# EAGLE design tempsensor_V3_02 (EAGLE 9.6.0)
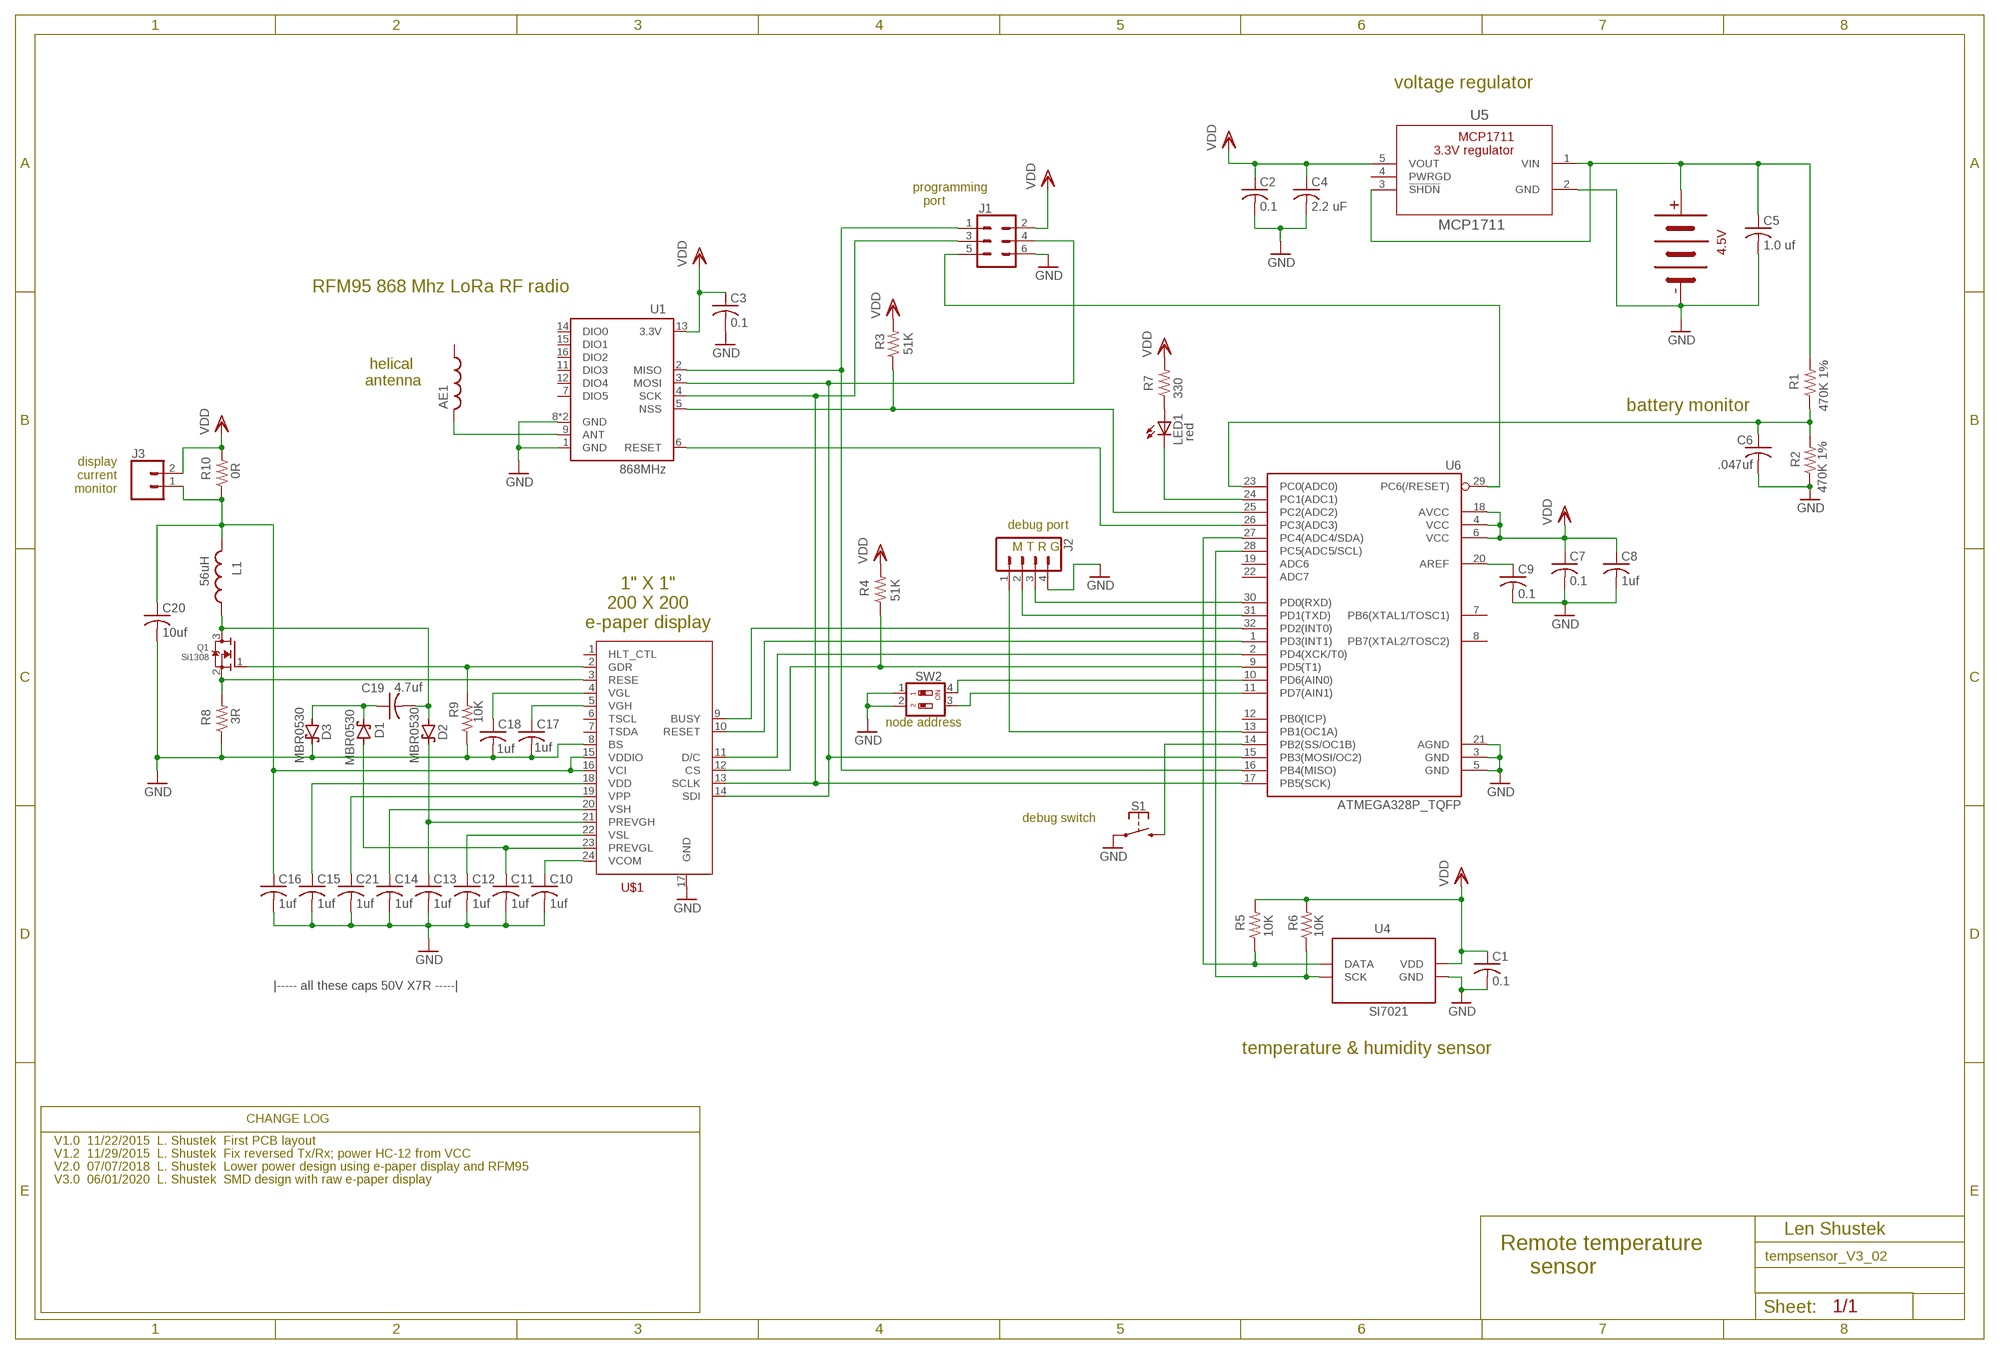
[diagram p0: schematic, sheet 1]

## Parts
AE1  ANTENNA-HELICAL  [ANTENNA-HELICAL_PULSE_SMD]
B1  3PC-BATTERY-HOLDER  [3AAA-BATTERY-HOLDER]
C1  0.1  C-USC0805  [C0805]
C2  0.1  C-USC0805  [C0805]
C3  0.1  C-USC0805  [C0805]
C4  2.2 uF  C-USC1210  [C1210]
C5  1.0 uf  C-USC0805  [C0805]
C6  .047uf  C-USC0805  [C0805]
C7  0.1  C-USC0805  [C0805]
C8  1uf  C-USC0805  [C0805]
C9  0.1  C-USC0805  [C0805]
C10  1uf  C-USC0805  [C0805]
C11  1uf  C-USC0805  [C0805]
C12  1uf  C-USC0805  [C0805]
C13  1uf  C-USC0805  [C0805]
C14  1uf  C-USC0805  [C0805]
C15  1uf  C-USC0805  [C0805]
C16  1uf  C-USC0805  [C0805]
C17  1uf  C-USC0805  [C0805]
C18  1uf  C-USC0805  [C0805]
C19  4.7uf  C-USC1210  [C1210]
C20  10uf  C-USC1210  [C1210]
C21  1uf  C-USC0805  [C0805]
D1  MBR0530  DIODE,SCHOTTKY  [SOD123-2]
D2  MBR0530  DIODE,SCHOTTKY  [SOD123-2]
D3  MBR0530  DIODE,SCHOTTKY  [SOD123-2]
J1  CONN_2X3  [2X3_SMT_RTANGLE_OUTLINE]
J2  CONN_04  [1X04]
J3  CONN_02  [1X02]
L1  56uH  L-USL1812  [L1812]
LED1  red  LEDPLCC-2  [LED_PLCC-2]
Q1  Si1308  MOSFET-NSC70-3-SMT  [SC70-3-R]
R1  470K 1%  R-US_M0805  [M0805]
R2  470K 1%  R-US_M0805  [M0805]
R3  51K  R-US_M0805  [M0805]
R4  51K  R-US_M0805  [M0805]
R5  10K  R-US_M0805  [M0805]
R6  10K  R-US_M0805  [M0805]
R7  330  R-US_M0805  [M0805]
R8  3R  R-US_M0805  [M0805]
R9  10K  R-US_M0805  [M0805]
R10  0R  R-US_M0805  [M0805]
S1  PUSHBUTTON-SPSTSWITCH_C&K_GULLWING_5MM  [SWITCH_C&K_GULLWING_5MM]
SW2  SWITCH-2POS-DIP  [SMS-002]
U1  868MHz  RFM69HCW-915  [RFM69HCW-XXXS2]
U4  SI7021  [DFN-6-3X3-SI7021]
U5  MCP1711  [SOT-23-5]
U6  ATMEGA328P_TQFP  [TQFP32-08]
U$1  E-PAPER-DISPLAYMOLEX  [MOLEX_50511]

## Nets
GND [GND]: B1.P$1 C1.2 C2.2 C3.2 C4.2 C5.2 C6.2 C7.2 C8.2 C9.2 C10.2 C11.2 C12.2 C13.2 C14.2 C15.2 C16.2 C17.2 C18.2 C20.2 C21.2 D3.P$2(C) J1.6 J2.4 R2.1 R8.1 R9.1 S1.P$1 S1.P$2 SW2.1 SW2.2 U1.1(GND) U1.8(GND) U1.10(GND) U4.GND U5.2(GND) U6.3(GND) U6.5(GND) U6.21(AGND) U$1.8(BS) U$1.17(GND)
N$1: R6.1 U4.SCK U6.28(PC5(ADC5/SCL))
N$2: R5.1 U4.DATA U6.27(PC4(ADC4/SDA))
N$3: J1.4 U1.3(MOSI) U6.15(PB3(MOSI/OC2)) U$1.14(SDI)
N$4: J1.1 U1.2(MISO) U6.16(PB4(MISO))
N$5: J1.3 U1.4(SCK) U6.17(PB5(SCK)) U$1.13(SCLK)
N$6: U1.6(RESET) U6.26(PC3(ADC3))
N$7: R3.1 U1.5(NSS) U6.25(PC2(ADC2))
N$8: U6.32(PD2(INT0)) U$1.9(BUSY)
N$9: U6.1(PD3(INT1)) U$1.10(RESET)
N$10: U6.2(PD4(XCK/T0)) U$1.11(D/C)
N$11: R4.1 U6.9(PD5(T1)) U$1.12(CS)
N$12: J2.2 U6.31(PD1(TXD))
N$13: LED1.P$2(C) U6.24(PC1(ADC1))
N$14: LED1.P$1(A) R7.1
N$15: SW2.4 U6.10(PD6(AIN0))
N$16: SW2.3 U6.11(PD7(AIN1))
N$17 [VCC]: B1.P$2 C5.1 R1.2 U5.1(VIN) U5.3(!SHDN)
N$18: C9.1 U6.20(AREF)
N$19 [VCC]: AE1.P$1 U1.9(ANT)
N$20: J1.5 U6.29(PC6(/RESET))
N$21: C10.1 U$1.24(VCOM)
N$22: C11.1 D1.P$1(A) U$1.23(PREVGL)
N$23: C12.1 U$1.22(VSL)
N$24: C13.1 D2.P$2(C) U$1.21(PREVGH)
N$25: C14.1 U$1.20(VSH)
N$26 [VCC]: C16.1 C20.1 J3.1 L1.2 R10.1 U$1.15(VDDIO) U$1.16(VCI)
N$27: C6.1 R1.1 R2.2 U6.23(PC0(ADC0))
N$28: C15.1 U$1.18(VDD)
N$29: C21.1 U$1.19(VPP)
N$30: C17.1 U$1.5(VGH)
N$31: J2.1 U6.13(PB1(OC1A))
N$32: C18.1 U$1.4(VGL)
N$33: C19.2 D2.P$1(A) L1.1 Q1.3(D)
N$34: C19.1 D1.P$2(C) D3.P$1(A)
N$35: Q1.1(G) R9.2 U$1.2(GDR)
N$36: Q1.2(S) R8.2 U$1.3(RESE)
N$37: J2.3 U6.30(PD0(RXD))
N$38: S1.P$3 S1.P$4 U6.14(PB2(SS/OC1B))
VDD [VCC]: C1.1 C2.1 C3.1 C4.1 C7.1 C8.1 J1.2 J3.2 R3.2 R4.2 R5.2 R6.2 R7.2 R10.2 U1.13(3.3V) U4.VDD U5.5(VOUT) U6.4(VCC) U6.6(VCC) U6.18(AVCC)
Unconnected: AE1.P$2 U1.7(DIO5) U1.11(DIO3) U1.12(DIO4) U1.14(DIO0) U1.15(DIO1) U1.16(DIO2) U6.7(PB6(XTAL1/TOSC1)) U6.8(PB7(XTAL2/TOSC2)) U6.12(PB0(ICP)) U6.19(ADC6) U6.22(ADC7) U$1.1(HLT_CTL) U$1.6(TSCL) U$1.7(TSDA)

## Notes on the sheet
- voltage regulator
- programming
     port
- RFM95 868 Mhz LoRa RF radio
- helical
  antenna
- battery monitor
- display
  current
  monitor
- debug port
- M T R G
- 1" X 1"
  200 X 200
  e-paper display
- node address
- debug switch
- |----- all these caps 50V X7R -----|
- temperature & humidity sensor
- CHANGE LOG
- V1.0  11/22/2015  L. Shustek  First PCB layout
- V1.2  11/29/2015  L. Shustek  Fix reversed Tx/Rx; power HC-12 from VCC
- V2.0  07/07/2018  L. Shustek  Lower power design using e-paper display and RFM95
- V3.0  06/01/2020  L. Shustek  SMD design with raw e-paper display
- Len Shustek
- Remote temperature
       sensor

## Power pins joined to a net without a drawn wire
PWRGD: U5.4(PWRGD)

## Library data of the parts
AE1 = Len:ANTENNA-HELICAL
B1 = Len:3PC-BATTERY-HOLDER
C1-C21 = resistor:C-US: CAPACITOR, American symbol
D1-D3 = Len:DIODE,SCHOTTKY: Schottky diode
J1 = Len:CONN_2X3: Multi connection point. Often used as Generic Header-pin footprint for 0.1 inch spaced/style header connections You can populate with any combo of single row headers, but if you'd like an exact match, check these: Header - 2x3 (Male, 0.1") <https://www.sparkfun.com/products/12807> (PRT-12807) Header - 2x3 (Female, 0.1") <https://www.sparkfun.com/products/13010> (PRT-13010) 2x3 Pin Shrouded Header <https://www.sparkfun.com/products/10877> (PRT-10877) On any of the 0.1 inch spaced packages, you can populate with these: Break Away Headers - Straight <https://www.sparkfun.com/products/116> (PRT-00116) Break Away Male Headers - Right Angle <https://www.sparkfun.com/products/553> (PRT-00553) Female Headers <https://www.sparkfun.com/products/115> (PRT-00115) Break Away Headers - Machine Pin <https://www.sparkfun.com/products/117> (PRT-00117) Break Away Female Headers - Swiss Machine Pin <https://www.sparkfun.com/products/743> (PRT-00743) Special note: the shrouded connector mates well with our 3x2 ribbon cables: Ribbon Crimp Connector - 6-pin (2x3, Female) <https://www.sparkfun.com/products/10651> (PRT-10651) Ribbon Cable - 6 wire (15ft) <https://www.sparkfun.com/products/10646> (PRT-10646)
J2 = SparkFun-Connectors:CONN_04: Multi connection point. Often used as Generic Header-pin footprint for 0.1 inch spaced/style header connections On any of the 0.1 inch spaced packages, you can populate with these: Break Away Headers - Straight <https://www.sparkfun.com/products/116> (PRT-00116) Break Away Male Headers - Right Angle <https://www.sparkfun.com/products/553> (PRT-00553) Female Headers <https://www.sparkfun.com/products/115> (PRT-00115) Break Away Headers - Machine Pin <https://www.sparkfun.com/products/117> (PRT-00117) Break Away Female Headers - Swiss Machine Pin <https://www.sparkfun.com/products/743> (PRT-00743) For SCREWTERMINALS and SPRING TERMINALS visit here: Screw Terimnals on SparkFun.com <https://www.sparkfun.com/search/results?term=Screw+Terminals> (5mm/3.5mm/2.54mm spacing) This device is also useful as a general connection point to wire up your design to another part of your project. Our various solder wires solder well into these plated through hole pads. Hook-Up Wire - Assortment (Stranded, 22 AWG) <https://www.sparkfun.com/products/11375> (PRT-11375) Hook-Up Wire - Assortment (Solid Core, 22 AWG) <https://www.sparkfun.com/products/11367> (PRT-11367) View the entire wire category on our website here <https://www.sparkfun.com/categories/141> Special notes: Molex polarized connector foot print use with SKU : PRT-08231 with associated crimp pins and housings. 1MM SMD Version SKU: PRT-10208; PROD_ID: CONN-09696
J3 = SparkFun-Connectors:CONN_02: Multi connection point. Often used as Generic Header-pin footprint for 0.1 inch spaced/style header connections On any of the 0.1 inch spaced packages, you can populate with these: Break Away Headers - Straight <https://www.sparkfun.com/products/116> (PRT-00116) Break Away Male Headers - Right Angle <https://www.sparkfun.com/products/553> (PRT-00553) Female Headers <https://www.sparkfun.com/products/115> (PRT-00115) Break Away Headers - Machine Pin <https://www.sparkfun.com/products/117> (PRT-00117) Break Away Female Headers - Swiss Machine Pin <https://www.sparkfun.com/products/743> (PRT-00743) For SCREWTERMINALS and SPRING TERMINALS visit here: Screw Terimnals on SparkFun.com <https://www.sparkfun.com/search/results?term=Screw+Terminals> (5mm/3.5mm/2.54mm spacing) This device is also useful as a general connection point to wire up your design to another part of your project. Our various solder wires solder well into these plated through hole pads. Hook-Up Wire - Assortment (Stranded, 22 AWG) <https://www.sparkfun.com/products/11375> (PRT-11375) Hook-Up Wire - Assortment (Solid Core, 22 AWG) <https://www.sparkfun.com/products/11367> (PRT-11367) View the entire wire category on our website here <https://www.sparkfun.com/categories/141> Special notes: Molex polarized connector foot print use with: PRT-08233 with associated crimp pins and housings. 2.54_SCREWTERM for use with PRT-10571. 3.5mm Screw Terminal footprints for PRT-08084 5mm Screw Terminal footprints for use with PRT-08432
L1 = resistor:L-US: INDUCTOR, American symbol
LED1 = Len:LED: LED OSRAM: - CHIPLED LG R971, LG N971, LY N971, LG Q971, LY Q971, LO R971, LY R971 LH N974, LH R974 LS Q976, LO Q976, LY Q976 LO Q996 - Hyper CHIPLED LW Q18S LB Q993, LB Q99A, LB R99A - SideLED LS A670, LO A670, LY A670, LG A670, LP A670 LB A673, LV A673, LT A673, LW A673 LH A674 LY A675 LS A676, LA A676, LO A676, LY A676, LW A676 LS A679, LY A679, LG A679 - Hyper Micro SIDELED® LS Y876, LA Y876, LO Y876, LY Y876 LT Y87S - SmartLED LW L88C, LW L88S LB L89C, LB L89S, LG L890 LS L89K, LO L89K, LY L89K LS L896, LA L896, LO L896, LY L896 - TOPLED LS T670, LO T670, LY T670, LG T670, LP T670 LSG T670, LSP T670, LSY T670, LOP T670, LYG T670 LG T671, LOG T671, LSG T671 LB T673, LV T673, LT T673, LW T673 LH T674 LS T676, LA T676, LO T676, LY T676, LB T676, LH T676, LSB T676, LW T676 LB T67C, LV T67C, LT T67C, LS T67K, LO T67K, LY T67K, LW E67C LS E67B, LA E67B, LO E67B, LY E67B, LB E67C, LV E67C, LT E67C LW T67C LS T679, LY T679, LG T679 LS T770, LO T770, LY T770, LG T770, LP T770 LB T773, LV T773, LT T773, LW T773 LH T774 LS E675, LA E675, LY E675, LS T675 LS T776, LA T776, LO T776, LY T776, LB T776 LHGB T686 LT T68C, LB T68C - Hyper Mini TOPLED® LB M676 - Mini TOPLED Santana® LG M470 LS M47K, LO M47K, LY M47K Source: http://www.osram.convergy.de/
Q1 = Len:MOSFET-N: N-Channel Mosfet 2N7002E - 60V 260mA SOT23 [Digikey: 2N7002ET1GOSTR-ND] - REEL BSH103 - 30V 850mA SOT23 [Digikey: 568-5013-1-ND]
R1-R10 = resistor:R-US_: RESISTOR, American symbol
S1 = Len:PUSHBUTTON-SPST: Momentary Switch (Pushbutton) - SPST - Two Circuits Normally-open (NO) SPST momentary switches
SW2 = Len:SWITCH-2POS-DIP: SMD Dip Switch 2 pol.
U1 = SparkFun-RF:RFM69H: Hope RF RFM69H ISM Transceiver Module The RFM69H is a transceiver module capable of operation over a wide frequency range, including the 315,433,868 and 915MHz license-free ISM (Industry Scientific and Medical) frequency bands. All major RF communication parameters are programmable and most of them can be dynamically set. The RFM69H offers the unique advantage of programmable narrow-band and wide- band communication modes. The RFM69H is optimized for low power consumption while offering high RF output power and channelized operation.Compliance ETSI and FCC regulations. Datasheet <http://www.hoperf.cn/upload/docs/RF/SX/RFM69H_DataSheet_v1.3.pdf> SparkFun Products RFM69HCW Wireless Transceiver - 915MHz <https://www.sparkfun.com/products/13909> (COM-13909) RFM69HCW Wireless Transceiver - 434MHz <https://www.sparkfun.com/products/13910> (COM-13910) SparkFun RFM69 Breakout (915MHz) <https://www.sparkfun.com/products/12775> (WRL-12775) SparkFun RFM69 Breakout (434MHz) <https://www.sparkfun.com/products/12823> (WRL-12823); PROD_ID: IC-11997; VALUE: 915MHz
U4 = Len:SI7021: Silicon Labs Si7021 I2C Humidity and Temperature Sensor The Si7021 is a low-cost, easy-to-use, highly accurate, digital humidity and temperature sensor. This sensor is ideal for environmental sensing and data logging and perfect for build a weather stations or humidor control system. All you need are two lines for I2C communication, and you’ll have relative humidity readings and very accurate temperature readings as a bonus! Datasheet <https://cdn.sparkfun.com/datasheets/Sensors/Weather/Si7021.pdf> SparkFun Products SparkFun Humidity and Temperature Sensor Breakout - Si7021 <https://www.sparkfun.com/products/13763> (SEN-13763) SparkFun Blynk Board - ESP8266 <https://www.sparkfun.com/products/13794> (WRL-13794); PROD_ID: IC-13093
U5 = MCP_1711:MCP1711; MANUFACTURER_PART_NUMBER: mcp1754; VENDOR: Microchip
U6 = SparkFun-IC-Microcontroller:ATMEGA328P_TQFP: Popular 328P in QFP Storefront component: ATmega328 - TQFP <https://www.sparkfun.com/products/13448> (COM-13448) Datasheet <http://www.sparkfun.com/datasheets/Components/SMD/ATMega328.pdf> SparkFun Products SparkFun RedBoard - Programmed with Arduino <https://www.sparkfun.com/products/12757> (DEV-12757) Arduino Pro Mini 328 - 5V/16MHz <https://www.sparkfun.com/products/11113> (DEV-11113) Arduino Pro Mini 328 - 3.3V/8MHz <https://www.sparkfun.com/products/11114> (DEV-11114) SparkFun OpenLog <https://www.sparkfun.com/products/13712> (DEV-13712) SparkFun MicroView - OLED Arduino Module <https://www.sparkfun.com/products/12923> (DEV-12923) SparkFun Digital Sandbox <https://www.sparkfun.com/products/12651> (DEV-12651) SparkFun PicoBoard <https://www.sparkfun.com/products/11888> (WIG-11888) Arduino Fio <https://www.sparkfun.com/products/10116> (DEV-10116) LilyPad Arduino 328 Main Board <https://www.sparkfun.com/products/13342> (DEV-13342) SparkFun RedStick <https://www.sparkfun.com/products/13741> (DEV-13741) LilyPad MP3 <https://www.sparkfun.com/products/11013> (DEV-11013) LilyPad Arduino SimpleSnap <https://www.sparkfun.com/products/10941> (DEV-10941) SparkFun Stepoko <https://www.sparkfun.com/products/13899> (ROB-13899) SparkFun Geiger Counter <https://www.sparkfun.com/products/11345> (SEN-11345) SparkFun EL Sequencer <https://www.sparkfun.com/products/12781> (COM-12781) Arduino Pro 328 - 5V/16MHz <https://www.sparkfun.com/products/10915> (DEV-10915) CryptoCape <https://www.sparkfun.com/products/12773> (DEV-12773) SparkFun IR Thermometer Evaluation Board - MLX90614 <https://www.sparkfun.com/products/10740> (SEN-10740) SparkFun RedBot Mainboard <https://www.sparkfun.com/products/12097> (ROB-12097) Arduino Pro 328 - 3.3V/8MHz <https://www.sparkfun.com/products/10914> (DEV-10914) SparkFun Block for Intel® Edison - Arduino <https://www.sparkfun.com/products/13036> (DEV-13036) SparkFun Simon Says - Surface Mount Soldering Kit <https://www.sparkfun.com/products/10935> (KIT-10935) SparkFun 7-Segment Serial Display - Red <https://www.sparkfun.com/products/11441> (COM-11441) SparkFun 7-Segment Serial Display - White <https://www.sparkfun.com/products/11629> (COM-11629) SparkFun 7-Segment Serial Display - Yellow <https://www.sparkfun.com/products/11443> (COM-11443) SparkFun 7-Segment Serial Display - Kelly Green <https://www.sparkfun.com/products/11440> (COM-11440) SparkFun 7-Segment Serial Display - Blue <https://www.sparkfun.com/products/11442> (COM-11442) SparkFun OpenSegment Serial Display - 20mm (Blue) <https://www.sparkfun.com/products/11647> (COM-11647) SparkFun OpenSegment Serial Display - 20mm (Green) <https://www.sparkfun.com/products/11646> (COM-11646) SparkFun OpenSegment Serial Display - 20mm (White) <https://www.sparkfun.com/products/11648> (COM-11648) SparkFun OpenSegment Serial Display - 20mm (Red) <https://www.sparkfun.com/products/11644> (COM-11644) SparkFun OpenSegment Serial Display - 20mm (Yellow) <https://www.sparkfun.com/products/11645> (COM-11645) SparkFun OpenSegment Shield <https://www.sparkfun.com/products/13190> (DEV-13190); PROD_ID: IC-09069
U$1 = Len:E-PAPER-DISPLAY: e-paper display

## Net classes
0 default: width 0.254 mm
1 GND: width 0.457 mm
2 VCC: width 0.457 mm

## Board
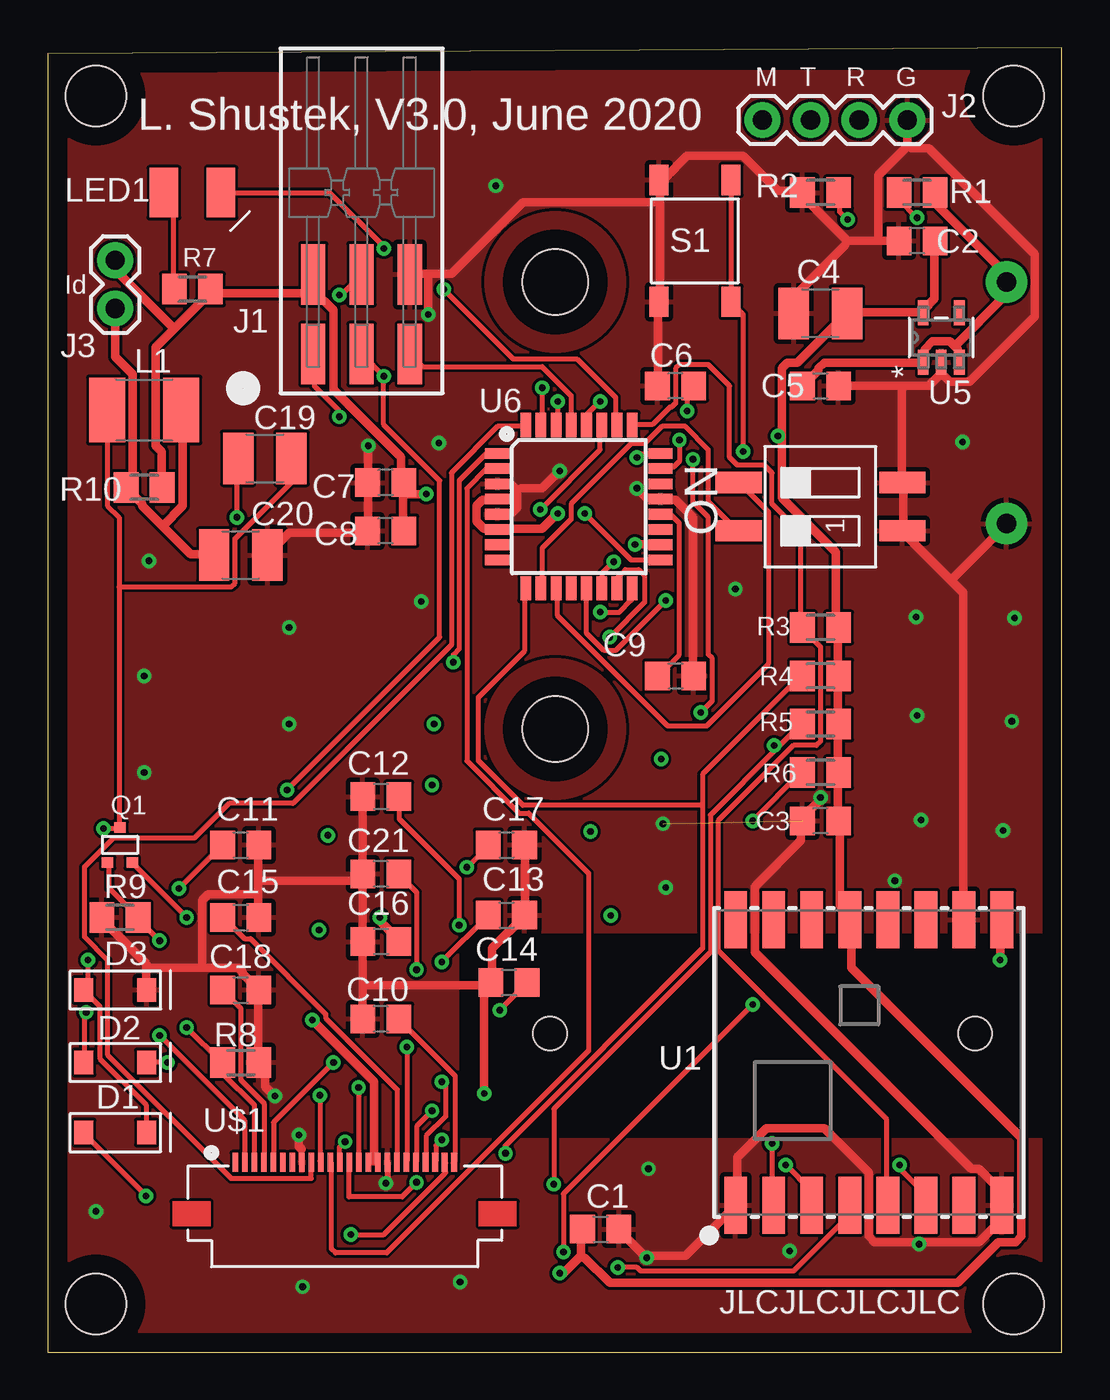
[diagram p1: board, top side]
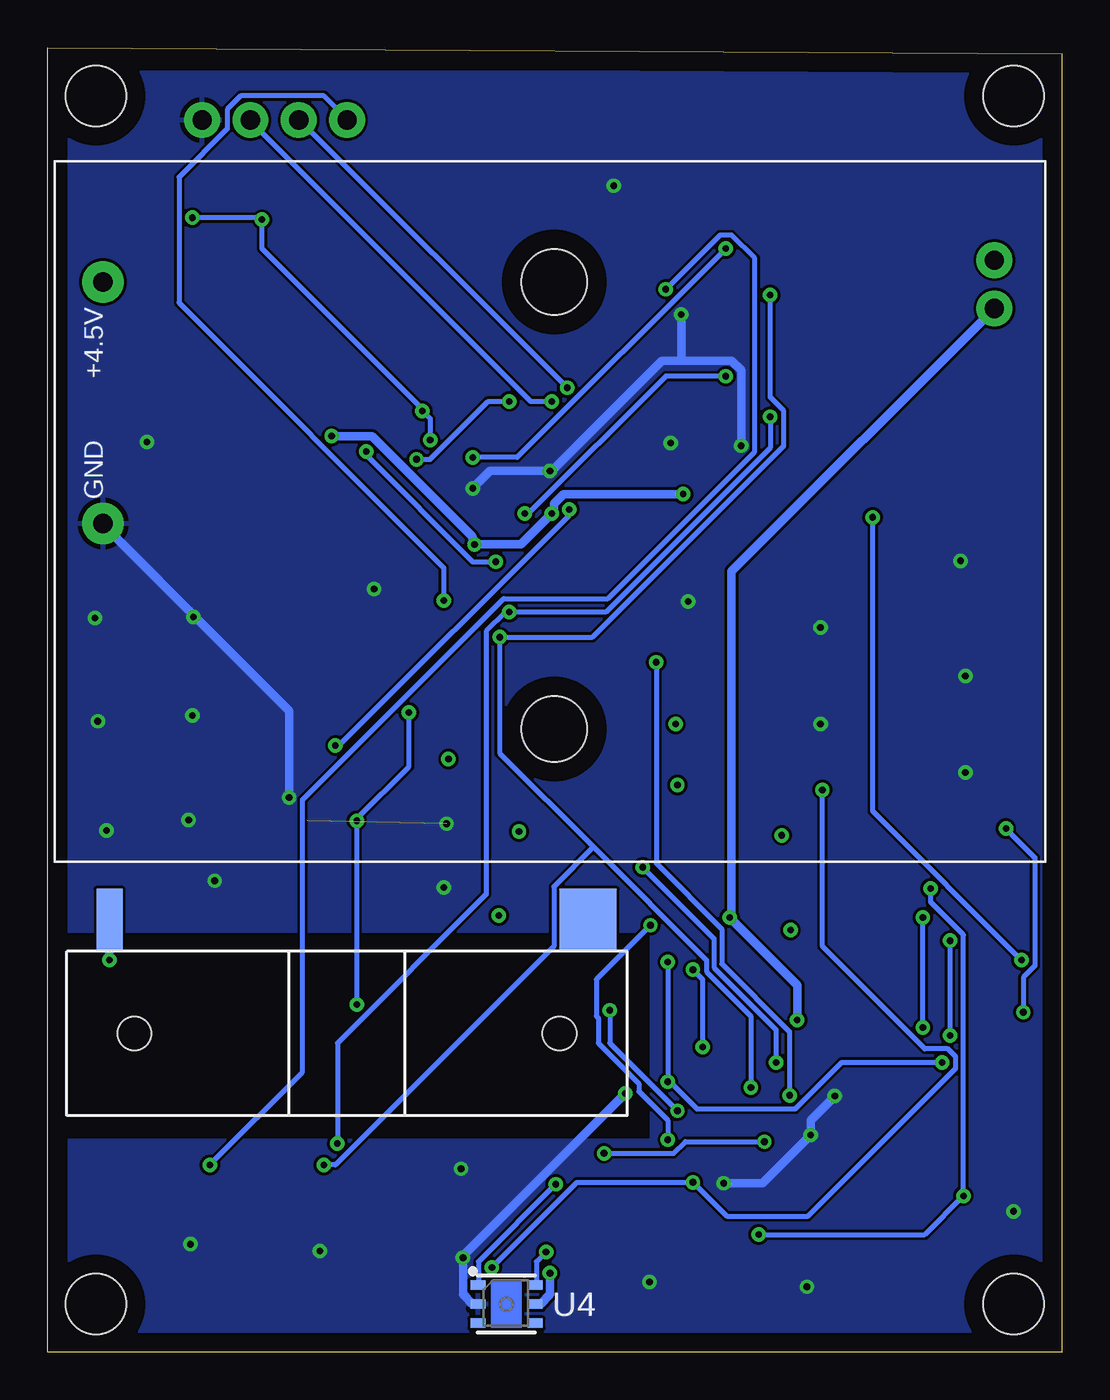
[diagram p2: board, bottom side, seen from below]

Size 53.34 x 68.58 mm. Coordinates in mm from the lower left corner, seen from the top.
Outline: 0,0 53.34,0 53.34,68.58 0,68.25 0,0
Copper layers (1*16): Top 0.035mm / dielectric 1.5mm / Bottom 0.035mm
Design rules "default": minimum track width 6mil, minimum drill 0.35mm, track to track 6mil, track to pad 6mil, pad to pad 6mil, via to via 6mil, smd to smd 6mil, copper to edge 40mil, drill to drill 6mil, minimum pad ring 10mil, minimum via ring 8mil, stop-mask expansion 4mil, vias tented up to drill 0mil, thermal gap 10mil
Holes 3.17 mm at 2.54,2.54 50.8,2.54 2.54,66.04 50.8,66.04

### Footprints (pad centres in the part's own frame; a part is rotated, then mirrored left to right if it is on the bottom)
ANTENNA-HELICAL_PULSE_SMD = smd 1.36 x 3.2: P$1 12.484,-6 | smd 3 x 3.2: P$2 -12.676,-6 | hole 1.778: -11.176,0; 11.176,0
3AAA-BATTERY-HOLDER = drill 1.016 pad 2.184: P$1 -6.35,0; P$2 6.35,0 | hole 3.454: 6.35,-23.724; -17.145,-23.724
C0805 = smd 1.3 x 1.5: 1 -0.95,0; 2 0.95,0
C1210 = smd 1.6 x 2.7: 1 -1.4,0; 2 1.4,0
SOD123-2 = smd 1 x 1.25: P$1 -1.65,0; P$2 1.65,0
2X3_SMT_RTANGLE_OUTLINE = smd 1.27 x 3.18: 1 2.54,2.146; 2 2.54,-2.045; 3 0,2.146; 4 0,-2.045; 5 -2.54,2.146; 6 -2.54,-2.045
1X04 = drill 1.016 pad 1.88: 1 0,0; 2 2.54,0; 3 5.08,0; 4 7.62,0
1X02 = drill 1.016 pad 1.88: 1 0,0; 2 2.54,0
L1812 = smd 1.9 x 3.4: 1 -1.95,0; 2 1.95,0
LED_PLCC-2 = smd 1.5 x 2.6: P$1 -1.5,0; P$2 1.5,0
SC70-3-R = smd 0.6 x 0.55: 1 -0.65,-0.925; 2 0.65,-0.925; 3 0,0.925
M0805 = smd 1.3 x 1.6: 1 -0.95,0; 2 0.95,0
SWITCH_C&K_GULLWING_5MM = smd 1.6 x 1: P$1 -3.2,1.9; P$2 3.2,1.9; P$3 -3.2,-1.9; P$4 3.2,-1.9
SMS-002 = smd 1.118 x 2.438: 1 -1.27,-4.305; 2 1.27,-4.305; 3 1.27,4.305; 4 -1.27,4.305
RFM69HCW-XXXS2 = smd 3 x 1.2: 1 -7.5,7; 2 -7.5,5; 3 -7.5,3; 4 -7.5,1; 5 -7.5,-1; 6 -7.5,-3; 7 -7.5,-5; 8 -7.5,-7; 9 7.5,-7; 10 7.5,-5; 11 7.5,-3; 12 7.5,-1; 13 7.5,1; 14 7.5,3; 15 7.5,5; 16 7.5,7
DFN-6-3X3-SI7021 = smd 0.8 x 0.5: DATA 1.5,-1; GND 1.5,0; NC@3 1.5,1; NC@4 -1.5,1; SCK -1.5,-1; VDD -1.5,0
SOT-23-5 = smd 1.321 x 0.559: 1 -1.295,0.95; 2 -1.295,0; 3 -1.295,-0.95; 4 1.295,-0.95; 5 1.295,0.95
TQFP32-08 = smd 1.27 x 0.559: 1 -4.293,2.8; 2 -4.293,2; 3 -4.293,1.2; 4 -4.293,0.4; 5 -4.293,-0.4; 6 -4.293,-1.2; 7 -4.293,-2; 8 -4.293,-2.8; 17 4.293,-2.8; 18 4.293,-2; 19 4.293,-1.2; 20 4.293,-0.4; 21 4.293,0.4; 22 4.293,1.2; 23 4.293,2; 24 4.293,2.8 | smd 0.559 x 1.27: 9 -2.8,-4.293; 10 -2,-4.293; 11 -1.2,-4.293; 12 -0.4,-4.293; 13 0.4,-4.293; 14 1.2,-4.293; 15 2,-4.293; 16 2.8,-4.293; 25 2.8,4.293; 26 2,4.293; 27 1.2,4.293; 28 0.4,4.293; 29 -0.4,4.293; 30 -1.2,4.293; 31 -2,4.293; 32 -2.8,4.293
MOLEX_50511 = smd 0.3 x 1: 1 -5.75,2.5; 2 -5.25,2.5; 3 -4.75,2.5; 4 -4.25,2.5; 5 -3.75,2.5; 6 -3.25,2.5; 7 -2.75,2.5; 8 -2.25,2.5; 9 -1.75,2.5; 10 -1.25,2.5; 11 -0.75,2.5; 12 -0.25,2.5; 13 0.25,2.5; 14 0.75,2.5; 15 1.25,2.5; 16 1.75,2.5; 17 2.25,2.5; 18 2.75,2.5; 19 3.25,2.5; 20 3.75,2.5; 21 4.25,2.5; 22 4.75,2.5; 23 5.25,2.5; 24 5.75,2.5

### Placement (x,y rotation side)
AE1  37.59,16.76 180 bottom
B1  50.42,49.91 90 bottom
C1  29.08,6.48 0 top
C2  45.72,58.42 180 top
C3  40.64,27.94 180 top
C4  40.64,54.61 180 top
C5  40.64,50.8 0 top
C6  33.02,50.8 180 top
C7  17.78,45.72 180 top
C8  17.78,43.18 180 top
C9  33.02,35.56 0 top
C10  17.53,17.53 180 top
C11  10.16,26.67 0 top
C12  17.53,29.21 180 top
C13  24.13,22.99 0 top
C14  24.26,19.43 180 top
C15  10.16,22.86 0 top
C16  17.53,21.59 180 top
C17  24.13,26.67 0 top
C18  10.16,19.05 0 top
C19  11.43,46.99 0 top
C20  10.16,41.91 0 top
C21  17.53,25.15 180 top
D1  3.56,11.56 0 top
D2  3.56,15.24 0 top
D3  3.56,19.05 0 top
J1  16.51,54.61 180 top
J2  37.59,64.77 0 top
J3  3.56,54.86 90 top
L1  5.08,49.53 0 top
LED1  7.62,60.96 0 top
Q1  3.81,26.67 0 top
R1  45.72,60.96 0 top
R2  40.64,60.96 0 top
R3  40.64,38.1 0 top
R4  40.64,35.56 0 top
R5  40.64,33.02 0 top
R6  40.64,30.48 0 top
R7  7.62,55.88 0 top
R8  10.16,15.24 180 top
R9  3.81,22.86 0 top
R10  5.08,45.47 0 top
S1  34.04,58.42 90 top
SW2  40.64,44.45 90 top
U1  43.18,15.24 90 top
U4  29.21,2.54 180 bottom
U5  46.99,53.34 90 top
U6  27.94,44.45 0 top
U$1  15.62,7.49 0 top

### Tracks (layer width: path | path; a pad name or v marks a point on that pad's centre or on a via)
GND  (via drill 0.35)  (1 unrouted)
  Top 0.305: U$1.17 17.87,8.98 | U$1.8 13.37,10.68
  Top 0.457: 5.18,20.22 5.18,20.42 2.95,22.66 2.95,22.86 R9.1 | 5.18,20.22 5.18,19.1 D3.P$2 | 5.18,20.22 8.13,20.22 | 8.13,20.22 10.06,20.22 10.26,20.02 10.26,19.91 10.97,19.2 C18.2 11.07,19 11.07,15.24 R8.1 11.43,14.92 11.43,13.97 11.93,13.47 v11.95,13.47 | C14.2 23.37,19.51 23.37,21.23 25.09,22.96 C13.2 25.09,23.16 25.09,26.62 C17.2 | 11.07,24.79 11.07,26.62 C11.2 | 11.07,24.79 11.07,24.08 | 11.07,24.08 11.07,22.86 C15.2 | 16.56,19.3 16.56,21.54 C16.2 16.56,21.74 16.56,25.09 C21.2 | 16.56,19.3 16.56,17.58 C10.2 | C12.2 16.56,29.16 16.56,25.3 C21.2 | 11.07,24.79 16.36,24.79 C21.2 | 16.56,19.3 23.16,19.3 C14.2 | 8.13,20.22 8.13,23.77 8.43,24.08 11.07,24.08 | C1.2 30.07,6.4 v31.5,4.98 31.7,5.08 33.53,5.08 36.17,7.72 U1.1 36.27,7.92 36.27,10.26 37.8,11.79 40.84,11.79 43.18,9.45 43.18,6.1 43.48,5.79 48.97,5.79 50.09,6.91 50.09,7.52 U1.8 50.09,7.82 50.09,8.53 48.97,9.65 48.56,9.65 37.19,21.03 37.19,24.49 39.62,26.92 39.62,27.94 C3.2 39.73,28.14 40.64,29.06 v40.64,29.16 | v22.96,13.61 22.96,19.1 C14.2 | 46.94,51.41 46.94,52.02 U5.2 | 46.94,51.41 46.33,50.8 44.91,50.8 | C5.2 44.91,50.8 | 47.5,40.59 45.11,42.98 SW2.1 45.01,43.18 45.01,45.72 SW2.2 44.91,45.92 44.91,50.8 | 47.5,40.59 48.16,39.93 48.16,22.76 U1.10 | 47.5,40.59 50.39,43.48 B1.P$1 | C20.2 11.58,41.96 12.7,43.08 16.66,43.08 C8.2 16.87,43.18 16.87,45.72 C7.2 16.87,45.92 v16.87,47.65 | 24.69,45.31 24.69,44.4 24.38,44.09 23.67,44.09 U6.5 | 24.69,45.31 24.38,45.62 23.67,45.62 U6.3 | C9.2 33.93,35.56 33.93,43.89 33.02,44.81 32.31,44.81 U6.21 32,44.91 31.5,44.91 v30.99,45.41 | v26.92,46.33 26.01,45.41 24.89,45.41 24.69,45.31
  Top 0.457: 42.06,58.42 43.69,58.42 | 43.69,58.42 C2.2 | 42.06,58.42 39.73,60.76 39.73,60.96 R2.1 39.52,61.06 38.41,61.06 36.58,62.89 33.63,62.89 32.41,61.67 S1.P$2 32.21,61.57 32.21,60.45 | C4.2 39.32,54.66 39.32,55.58 41.96,58.22 42.06,58.42 | 45.21,63.4 J2.4 | 45.21,63.4 43.69,61.87 43.69,58.42 | C6.2 32.11,50.8 32.11,55.17 S1.P$1 32.21,55.37 32.21,60.45 | 20.02,56.69 21.23,56.69 24.99,60.45 32.21,60.45 | 20.02,56.69 19.1,56.69 J1.6 | 20.02,56.69 v20.02,54.56 | 46.94,51.41 47.14,51.31 47.45,51 48.46,51 51.92,54.46 51.92,57.71 46.33,63.3 45.41,63.3 45.21,63.4 | 17.87,8.98 v17.78,8.89 | v13.21,11.43 13.21,10.85 13.37,10.68
  Bottom 0.457: U4.GND 30.99,2.54 31.5,3.05 v31.5,4.98 31.39,5.18 v22.96,13.61 | v30.99,45.41 30.07,46.33 v26.92,46.33 26.72,46.43 21.03,52.12 20.02,52.12 | v16.87,47.65 16.87,51.61 17.37,52.12 20.02,52.12 | v20.02,54.56 20.02,52.12 | v40.64,29.16 40.64,33.73 50.39,43.48 B1.P$1 | v17.78,8.89 15.75,8.89 v13.21,11.43 13.21,12.21 v11.95,13.47
  other vias: 5.08,35.56 5.08,30.48 5.33,41.61 12.7,38.1 12.7,33.02 19.66,39.47 45.92,27.99 45.72,33.48 45.67,38.66 50.85,38.61 50.7,33.17 50.24,27.43 48.11,47.85 23.57,61.32 20.57,47.8 36.17,40.13 32.36,27.79 32.51,24.43 44.55,24.79 45.82,5.69 39.01,5.33 31.6,9.65 21.69,3.71 13.41,3.45 2.54,7.42
  pour Bottom: 0.76,67.31 0.76,0.51 52.32,0.51 52.32,11.18 21.59,11.18 21.59,22.1 52.32,22.1 52.32,67.31
  pour Top: 1.02,67.31 1.02,0.25 52.58,0.25 52.58,11.18 21.59,11.18 21.59,22.1 52.32,22.1 52.32,67.31
N$1  (via drill 0.35)
  Top 0.254: v27.13,5.28 27.13,8.33 v37.08,18.29 | v37.08,27.94 39.62,30.48 R6.1 | v29.06,49.99 28.35,49.28 28.35,48.77 U6.28 | v33.93,46.94 33.93,44.7 34.75,43.89 34.75,36.68 34.95,36.47 34.95,34.24 v34.34,33.63
  Bottom 0.254: v27.13,5.28 27.64,4.78 27.64,3.56 U4.SCK | v37.08,18.29 v37.08,27.94 37.08,28.04 34.34,30.79 v34.34,33.63 | v29.06,49.99 30.18,49.99 33.22,46.94 v33.93,46.94
N$2  (via drill 0.35)
  Top 0.254: v26.62,8.84 26.62,12.8 34.85,21.03 34.85,28.25 38.35,31.75 | 38.35,31.75 39.62,33.02 R5.1 | v25.91,44.3 29.06,47.45 29.06,48.67 U6.27 | 38.35,31.75 v38.2,31.9
  Bottom 0.254: v26.62,8.84 30.68,4.78 30.68,3.56 U4.DATA | v25.91,44.3 25.91,43.99 38,31.9 v38.2,31.9
N$3  (via drill 0.35)
  Top 0.254: v16.36,13.92 16.36,10.06 U$1.14 | v29.57,37.59 31.39,39.42 31.39,40.84 31.09,41.15 30.38,41.15 29.97,40.74 29.97,40.23 U6.15 | v38.81,9.86 40.13,8.53 40.13,7.82 U1.3 | v15.34,55.58 15.44,55.58 16.46,56.59 J1.4
  Bottom 0.254: v16.36,13.92 16.36,17.68 18.69,20.02 18.69,20.62 24.64,26.57 | 24.64,26.57 29.57,31.5 v29.57,37.59 24.69,37.59 14.63,47.65 14.63,49.48 15.34,50.19 v15.34,55.58 | v38.81,9.86 38.2,9.86 26.72,21.34 26.72,24.49 24.64,26.57
N$4  (via drill 0.35)
  Top 0.254: v29.06,38.91 30.07,38.91 30.68,39.52 30.68,40.13 U6.16 | v15.34,49.17 15.34,49.48 14.02,50.8 14.02,52.43 J1.1 | v38.1,10.97 38.1,7.82 U1.2
  Bottom 0.254: v15.34,49.17 15.34,47.55 23.98,38.91 v29.06,38.91 29.26,38.91 30.28,37.9 30.28,24.08 38.1,16.26 v38.1,10.97
N$5  (via drill 0.35)
  Top 0.254: v28.25,44.09 30.68,41.66 32.21,41.66 U6.17 | J1.3 16.56,52.43 v17.68,51.31 17.68,48.77 20.62,45.82 20.62,37.59 v12.6,29.57 | v19.41,8.94 18.64,8.18 15.85,8.18 15.85,9.96 U$1.13 | v29.97,4.47 30.99,4.47 31.19,4.27 39.22,4.27 42.16,7.21 42.16,7.72 U1.4
  Bottom 0.254: v28.25,44.09 28.04,44.09 20.83,51.31 v17.68,51.31 | v29.97,4.47 25.5,8.94 v19.41,8.94 17.63,7.16 13.36,7.16 5.59,14.94 5.59,15.54 5.99,15.95 7.21,15.95 12.6,21.34 v12.6,29.57
N$6  (via drill 0.35)
  Top 0.254: v20.83,55.88 24.49,52.22 27.84,52.22 29.87,50.19 29.87,48.77 U6.26 | v44.81,9.86 44.81,9.65 46.13,8.33 46.13,7.82 U1.6
  Bottom 0.254: v20.83,55.88 17.98,58.73 17.37,58.73 16.15,57.51 16.15,47.35 23.88,39.62 29.36,39.62 39.93,29.06 39.93,14.73 v44.81,9.86
N$7
  Top 0.254: U6.25 30.79,48.77 31.8,48.77 32.72,49.68 32.82,49.68 33.02,49.89 33.02,51.71 33.22,51.92 34.75,51.92 35.87,50.8 35.87,47.04 36.27,46.63 37.69,46.63 38.1,46.23 38.1,44.6 39.62,43.08 39.62,38.1 R3.1 39.73,38 40.64,37.08 40.64,32.11 40.44,31.9 39.22,31.9 35.26,27.94 35.26,21.13 44.09,12.29 44.09,7.82 U1.5
N$8
  Top 0.254: U$1.9 13.87,9.14 9.65,9.14 3.15,15.65 3.15,20.62 1.93,21.84 1.93,25.5 3.45,27.03 7.72,27.03 9.55,28.85 12.9,28.85 21.23,37.19 21.23,46.23 23.67,48.67 25.09,48.67 U6.32
N$9  (via drill 0.35)
  Top 0.254: v14.33,13.51 14.33,10.06 U$1.10 | v21.34,36.27 21.34,36.68 21.64,36.98 21.64,45.82 23.06,47.24 23.57,47.24 U6.1
  Bottom 0.254: v14.33,13.51 14.33,16.87 17.88,20.42 17.88,22.25 21.34,25.7 v21.34,36.27
N$10
  Top 0.254: U$1.11 14.94,9.96 14.94,5.44 15.14,5.23 17.83,5.23 28.45,15.85 28.45,25.2 25.3,28.35 24.79,28.35 22.05,31.09 22.05,45.41 23.06,46.43 23.57,46.43 U6.2
N$11  (via drill 0.35)
  Top 0.254: v15.65,11.07 15.34,10.77 15.34,10.06 U$1.12 | v24.08,10.46 24.08,10.87 34.44,21.23 34.44,28.75 | 34.44,28.75 34.44,30.38 39.62,35.56 R4.1 | 34.44,28.75 24.99,28.75 22.66,31.09 22.66,34.44 25.09,36.88 25.09,40.13 U6.9
  Bottom 0.254: v15.65,11.07 19.81,11.07 20.42,10.46 v24.08,10.46
N$12  (via drill 0.35)
  Top 0.254: v26.01,50.7 26.01,48.77 U6.31
  Bottom 0.254: v26.01,50.7 40.13,64.82 J2.2
N$13  (via drill 0.35)
  Top 0.254: v30.99,47.04 31.19,47.24 32.21,47.24 U6.24 | v17.68,58.01 17.48,58.22 17.48,58.32 14.83,60.96 LED1.P$2
  Bottom 0.254: v30.99,47.04 28.65,47.04 v17.68,58.01
N$14
  Top 0.254: R7.1 6.6,55.88 6.6,60.55 6.2,60.96 LED1.P$1
N$15
  Top 0.254: U6.10 26.01,40.23 26.01,42.27 27.53,43.79 27.53,44.6 30.68,47.75 31.39,47.75 32.31,48.67 33.53,48.67 34.75,47.45 34.75,44.7 36.27,43.18 SW2.4
N$16
  Top 0.254: U6.11 26.82,40.13 26.82,38.71 32.61,32.92 34.65,32.92 37.9,36.17 37.9,44.2 36.37,45.72 SW2.3
N$17
  Top 0.457: 47.7,52.88 47.85,52.73 47.85,52.12 U5.3 | 47.7,52.88 47.45,53.14 46.53,53.14 46.13,52.73 46.13,52.12 U5.1 45.82,52.02 40.84,52.02 40.54,51.71 40.54,51.61 39.73,50.8 C5.1 | R1.2 46.74,60.96 46.74,60.35 50.39,56.69 50.39,56.29 B1.P$2 50.29,56.08 50.29,55.47 47.7,52.88
N$18
  Top 0.254: U6.20 32.31,43.99 32.82,43.99 33.22,43.59 33.22,36.68 32.11,35.56 C9.1
N$19  (via drill 0.35)
  Top 0.254: 50.09,22.66 U1.9
  Top 0.457: v50.09,20.62 50.09,22.66
  Bottom 0.254: AE1.P$1
  Bottom 0.457: AE1.P$1 v50.09,20.62
N$20
  Top 0.254: U6.29 27.53,48.77 27.53,50.29 26.01,51.82 19.71,51.82 19.1,52.43 J1.5
N$21
  Top 0.254: U$1.24 21.44,10.06 21.44,14.53 18.49,17.48 C10.1
N$22  (via drill 0.35)
  Top 0.254: v15.95,6.2 17.68,6.2 20.93,9.45 20.93,9.96 U$1.23 | v5.18,8.23 1.93,11.48 D1.P$1 | v6.91,24.38 9.14,26.62 C11.1
  Bottom 0.254: v15.95,6.2 7.21,6.2 v5.18,8.23 5.18,21.95 6.91,23.67 v6.91,24.38
N$23  (via drill 0.35)
  Top 0.254: v20.73,11.18 20.42,10.87 20.42,10.06 U$1.22 | v21.64,22.45 21.64,24.89 18.49,28.04 18.49,29.16 C12.1
  Bottom 0.254: v20.73,11.18 20.73,12.19 22.25,13.72 22.25,14.12 24.38,16.26 24.38,17.58 24.49,17.68 24.49,19.61 v21.64,22.45
N$24  (via drill 0.35)
  Top 0.254: v20.73,14.22 20.93,14.02 20.93,12.39 19.91,11.38 19.91,10.06 U$1.21 | v20.73,20.52 23.16,22.96 C13.1 | v6.3,15.24 D2.P$2
  Bottom 0.254: v20.73,20.52 v20.73,14.22 20.62,14.22 19.2,12.8 14.02,12.8 11.58,15.24 v6.3,15.24
N$25  (via drill 0.35)
  Top 0.254: v20.22,12.7 19.41,11.89 19.41,10.06 U$1.20 | v23.77,17.98 25.2,19.41 C14.1
  Bottom 0.254: v20.22,12.7 23.77,16.26 v23.77,17.98
N$26  (via drill 0.35)
  Top 0.305: 16.97,10.06 U$1.15 | 17.27,10.06 U$1.16
  Top 0.457: 17.27,10.06 17.17,10.06 | 17.17,10.06 16.97,10.06 | 17.17,10.06 17.17,14.22 v13.92,17.48 | v17.48,22.86 17.48,22.66 18.49,21.64 C16.1 | 6.04,43.43 7.52,41.96 8.74,41.96 C20.1 | 6.04,43.43 4.98,44.5 4.98,44.6 4.17,45.41 R10.1 4.27,45.62 4.47,45.82 4.47,51.41 3.56,52.32 J3.1 | 6.04,43.43 7.11,44.5 7.11,49.48 L1.2
  Bottom 0.457: v13.92,17.48 13.92,19.3 v17.48,22.86 17.37,23.06 17.37,41.05 J3.1
N$27  (via drill 0.35)
  Top 0.254: v33.22,47.95 33.22,46.84 32.92,46.53 32.31,46.53 U6.23 | v33.63,49.48 33.63,50.49 33.93,50.8 C6.1 | v42.06,59.54 41.66,59.94 41.66,60.96 R2.2 | v45.72,59.64 44.81,60.55 44.81,60.96 R1.1
  Bottom 0.254: v33.22,47.95 33.22,49.07 v33.63,49.48 33.63,49.58 42.06,58.01 v42.06,59.54 42.06,59.64 v45.72,59.64
N$28
  Top 0.254: U$1.18 18.39,10.06 18.39,13.82 14.63,17.58 14.63,17.78 10.67,21.74 10.36,21.74 9.25,22.86 C15.1
N$29  (via drill 0.35)
  Top 0.254: v18.9,16.05 18.9,10.06 U$1.19 | v19.41,20.12 19.41,24.18 18.49,25.09 C21.1
  Bottom 0.254: v18.9,16.05 18.9,19.61 v19.41,20.12
N$30  (via drill 0.35)
  Top 0.254: v15.04,15.24 11.89,12.09 11.89,10.06 U$1.5 | v22.05,25.5 23.16,26.62 C17.1
  Bottom 0.254: v15.04,15.24 15.04,16.97 18.29,20.22 18.29,21.74 v22.05,25.5
N$31  (via drill 0.35)
  Top 0.254: v32.51,39.52 29.87,36.88 29.26,36.88 28.35,37.8 28.35,40.13 U6.13
  Bottom 0.254: v32.51,39.52 32.51,41.25 46.43,55.17 46.43,61.77 43.89,64.31 43.89,65.33 43.18,66.04 38.81,66.04 37.59,64.82 J2.1
N$32
  Top 0.254: U$1.4 11.38,10.06 11.38,13.11 10.16,14.33 10.16,18.09 9.25,19 C18.1
N$33  (via drill 0.35)
  Top 0.254: 3.76,40.23 3.76,43.89 3.15,44.5 3.15,49.48 L1.1 | 3.76,40.23 3.76,27.64 Q1.3 3.76,27.53 v2.95,27.53 | v2.03,17.88 1.93,17.78 1.93,15.24 D2.P$1 | 3.76,40.23 9.65,40.23 9.86,40.44 9.86,42.77 12.8,45.72 12.8,46.94 C19.2
  Bottom 0.254: v2.03,17.88 2.03,19.71 1.42,20.32 1.42,26.01 v2.95,27.53
N$34  (via drill 0.35)
  Top 0.254: D1.P$2 5.18,11.58 5.18,13.01 2.74,15.44 2.74,18.19 1.93,19 D3.P$1 1.93,19.1 2.13,19.3 v2.13,20.62 | v9.96,43.89 9.96,46.94 C19.1
  Bottom 0.254: v9.96,43.89 9.96,28.45 v2.13,20.62
N$35  (via drill 0.35)
  Top 0.254: Q1.1 3.25,25.7 3.25,24.38 4.78,22.86 R9.2 4.78,22.76 v5.89,21.64 | v5.89,16.66 10.36,12.19 10.36,10.06 U$1.2
  Bottom 0.254: v5.89,21.64 v5.89,16.66
N$36  (via drill 0.35)
  Top 0.254: v7.32,22.86 4.47,25.7 Q1.2 | v7.32,17.07 9.14,15.24 R8.2 9.25,15.14 9.25,14.63 10.87,13.01 10.87,10.06 U$1.3
  Bottom 0.254: v7.32,17.07 v7.32,22.86
N$37  (via drill 0.35)
  Top 0.254: v26.82,49.99 26.82,48.77 U6.30
  Bottom 0.254: v26.82,49.99 27.94,49.99 42.67,64.72 J2.3
N$38  (via drill 0.35)
  Top 0.254: v29.77,41.55 29.16,40.95 29.16,40.23 U6.14 | v36.58,47.35 36.58,54.56 35.97,55.17 S1.P$3 35.97,55.27 35.97,61.57 S1.P$4
  Bottom 0.254: v29.77,41.55 30.99,41.55 36.58,47.14 v36.58,47.35
N$39  (via drill 0.35)
  other vias: 20.32,33.02
N$40  (via drill 0.35)
  other vias: 14.73,27.18
N$41  (via drill 0.35)
  other vias: 14.27,22.2
N$42  (via drill 0.35)
  other vias: 20.22,29.82
N$43  (via drill 0.35)
  other vias: 32.26,31.19
N$44  (via drill 0.35)
  other vias: 28.55,27.38
N$45  (via drill 0.35)
  other vias: 29.62,22.96
VDD  (via drill 0.35)
  Top 0.457: 6.66,53.8 8.53,55.68 8.53,55.88 R7.2 8.74,55.68 13.82,55.68 J1.2 14.02,56.59 14.02,55.78 15.04,54.76 15.04,50.6 18.59,47.04 18.59,45.92 C7.1 | 6.66,53.8 5.69,52.83 5.69,47.65 5.99,47.35 5.99,45.52 R10.2 | J3.2 3.56,56.9 6.66,53.8 | U6.4 23.57,44.81 22.86,44.81 22.55,44.5 22.55,43.69 22.96,43.28 23.57,43.28 U6.6 23.88,43.28 26.01,43.28 v26.82,44.09 | v30.89,42.47 32.21,42.47 U6.18 | C8.1 18.69,43.18 18.69,45.72 C7.1 | v19.91,45.11 18.9,45.11 C7.1 | C2.1 46.63,58.42 46.63,55.37 46.13,54.86 U5.5 46.02,54.66 42.06,54.66 C4.1 41.86,54.46 39.42,52.02 38.91,52.02 38.61,51.71 38.61,48.16 | 38.61,48.16 38.61,44.91 41.45,42.06 41.45,38.3 R3.2 41.55,38.1 41.55,35.76 R4.2 41.55,35.56 41.55,33.22 R5.2 41.55,33.02 41.55,30.68 R6.2 41.55,30.48 41.55,27.94 C3.1 41.66,27.74 41.66,23.47 42.16,22.96 U1.13 42.27,22.66 42.27,20.22 51.21,11.28 51.21,6.1 50.9,5.79 49.99,5.79 47.85,3.66 29.57,3.66 28.25,4.98 28.04,5.08 | v26.92,4.17 27.13,4.17 28.04,5.08 | 28.04,5.08 28.04,6.4 C1.1 | v38.41,48.16 38.61,48.16
  Bottom 0.457: v19.91,45.11 26.21,45.11 26.72,44.6 26.72,44.3 v26.82,44.09 28.45,42.47 v30.89,42.47 30.99,42.67 30.99,42.88 36.27,48.16 v38.41,48.16 | U4.VDD 27.43,2.54 26.92,3.05 v26.92,4.17

### Text on the board
tPlace: M T R G | L. Shustek, V3.0, June 2020 | Id | JLCJLCJLCJLC
tNames: ON